# Altium schematic sheet MOTOR CONTROL.SchDoc
size A4
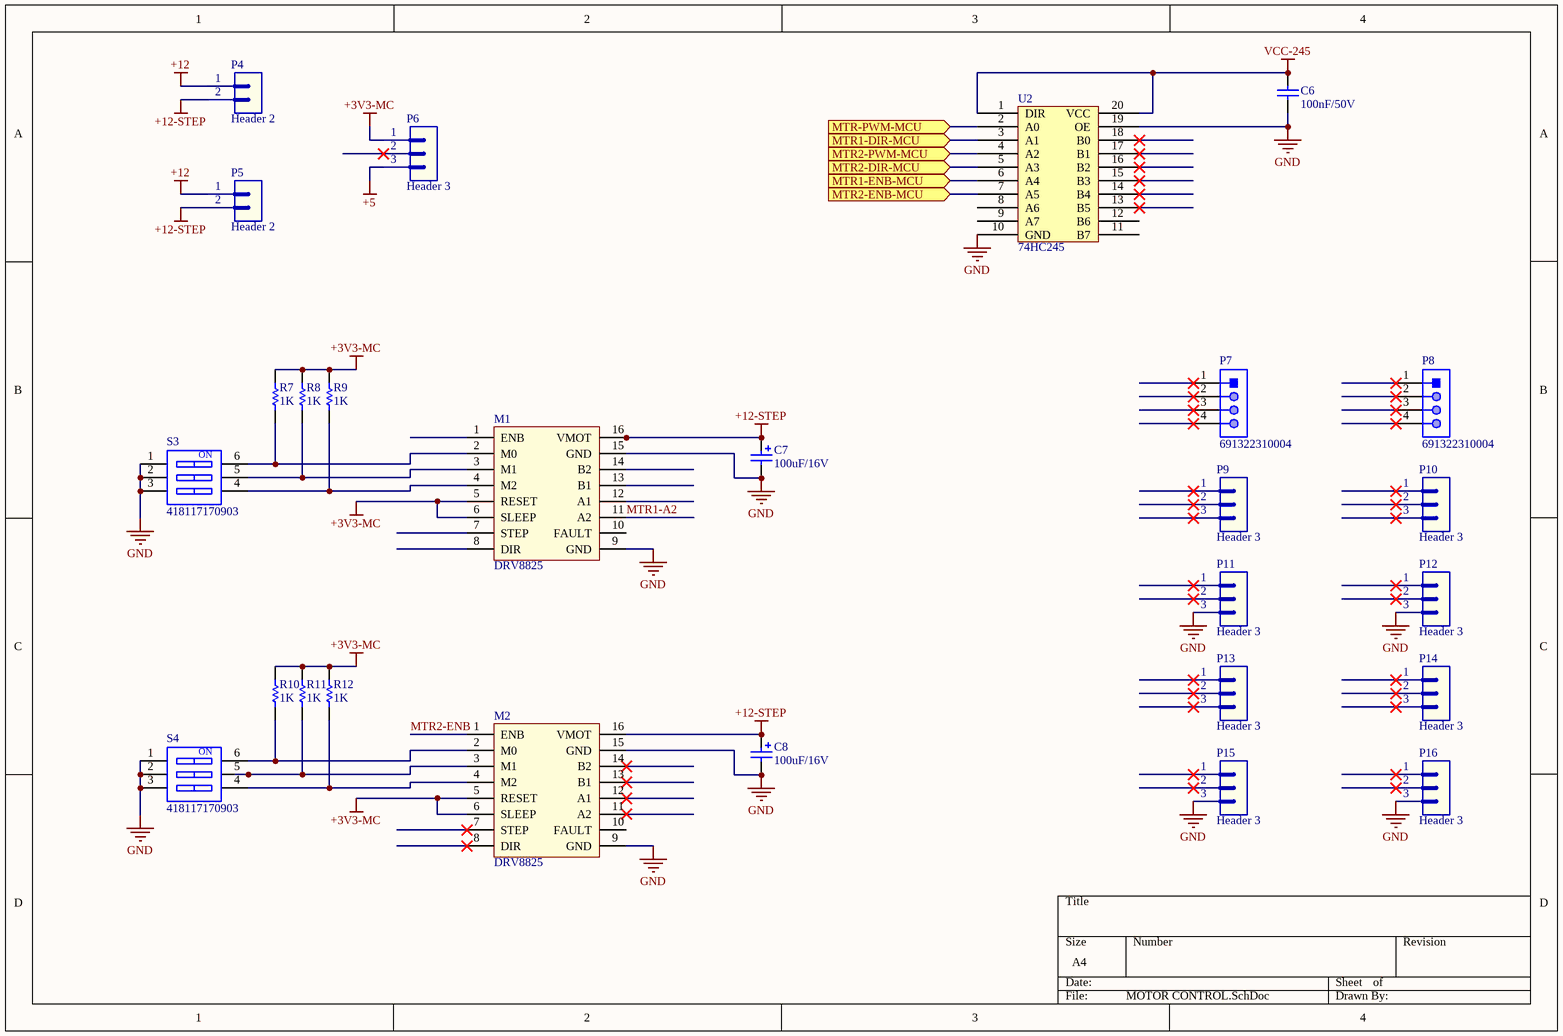
[diagram p0: MOTOR CONTROL.SchDoc]

## Parts
C6  value 100nF/50V  [CAP-SM-0805]  (hidden comment: Cap-100nF-50V-0805)
C7  value 100uF/16V  [CAP-SM-AL-SIZE-D-D6L6]  (hidden comment: Cap-Al-100uF-16V-D6L5)
C8  value 100uF/16V  [CAP-SM-AL-SIZE-D-D6L6]  (hidden comment: Cap-Al-100uF-16V-D6L5)
M1  DRV8825
M2  DRV8825
P4  Header 2  [JP2]
P5  Header 2  [JP2]
P6  Header 3  [JP3]
P7  691322310004  [691322310004]
P8  691322310004  [691322310004]
P9  Header 3  [JP3]
P10  Header 3  [JP3]
P11  Header 3  [JP3]
P12  Header 3  [JP3]
P13  Header 3  [JP3]
P14  Header 3  [JP3]
P15  Header 3  [JP3]
P16  Header 3  [JP3]
R7  value 1K  [RES-SM-0805]  (hidden comment: Res-1K-0805)
R8  value 1K  [RES-SM-0805]  (hidden comment: Res-1K-0805)
R9  value 1K  [RES-SM-0805]  (hidden comment: Res-1K-0805)
R10  value 1K  [RES-SM-0805]  (hidden comment: Res-1K-0805)
R11  value 1K  [RES-SM-0805]  (hidden comment: Res-1K-0805)
R12  value 1K  [RES-SM-0805]  (hidden comment: Res-1K-0805)
S3  418117170903  [418117170903]
S4  418117170903  [418117170903]
U2  74HC245  [DIP20/W0.3]

## Ports
MTR1-DIR-MCU (in), MTR1-ENB-MCU (in), MTR2-DIR-MCU (in), MTR2-ENB-MCU (in), MTR2-PWM-MCU (in), MTR-PWM-MCU (in)

## Nets
+3V3-MC: M1.5(RESET) M1.6(SLEEP) M2.5(RESET) M2.6(SLEEP) P6.1 R7.2 R8.2 R9.2 R10.2 R11.2 R12.2
+5: P6.3
+12: P4.1 P5.1
+12-STEP: C7.1 C8.1 M1.16(VMOT) M2.16(VMOT) P4.2 P5.2
GND: C6.1 C7.2 C8.2 M1.9(GND) M1.15(GND) M2.9(GND) M2.15(GND) P11.3 P12.3 P15.3 P16.3 S3.1 S3.2 S3.3 S4.1 S4.2 S4.3 U2.10(GND) U2.19(OE)
VCC-245: C6.2 U2.1(DIR) U2.20(VCC)
MTR1-A2: M1.11(A2)
MTR1-DIR-MCU: U2.3(A1) ; port MTR1-DIR-MCU
MTR1-ENB-MCU: U2.6(A4) ; port MTR1-ENB-MCU
MTR2-DIR-MCU: U2.5(A3) ; port MTR2-DIR-MCU
MTR2-ENB: M2.1(ENB)
MTR2-ENB-MCU: U2.7(A5) ; port MTR2-ENB-MCU
MTR2-PWM-MCU: U2.4(A2) ; port MTR2-PWM-MCU
MTR-PWM-MCU: U2.2(A0) ; port MTR-PWM-MCU
NetM1_2: M1.2(M0) R7.1 S3.6
NetM1_3: M1.3(M1) R8.1 S3.5
NetM1_4: M1.4(M2) R9.1 S3.4
NetM2_2: M2.2(M0) R10.1 S4.6
NetM2_3: M2.3(M1) R11.1 S4.5
NetM2_4: M2.4(M2) R12.1 S4.4

Not connected (* = marked no-connect by the designer): M1 1(ENB) 7(STEP) 8(DIR) 10(FAULT) 12(A1) 13(B1) 14(B2); M2 7(STEP)* 8(DIR)* 10(FAULT) 11(A2)* 12(A1)* 13(B1)* 14(B2)*; P6 2*; P7 1* 2* 3* 4*; P8 1* 2* 3* 4*; P9 1* 2* 3*; P10 1* 2* 3*; P11 1* 2*; P12 1* 2*; P13 1* 2* 3*; P14 1* 2* 3*; P15 1* 2*; P16 1* 2*; U2 8(A6) 9(A7) 11(B7) 12(B6) 13(B5)* 14(B4)* 15(B3)* 16(B2)* 17(B1)* 18(B0)*

## Notes on the sheet
- (in symbol 418117170903) ON

## Library data of the parts
C6 = Cap-100nF-50V-0805: CAP CER 0.1UF 50V Y5V 0805; Manufacturer: Samsung Electro-Mechanics; Manufacturer Part Number: CL21F104ZBCNNNC; Local Supplier: thegioiic; Local Supplier Link: https://thegioiic.com/products/tu-100nf-0-1uf-50v-0805; Supplier 1: Digikey; Supplier 1 Part Number: 1276-1007-1-ND; Supplier 1 Link: https://www.digikey.com/product-detail/en/samsung-electro-mechanics/CL21F104ZBCNNNC/1276-1007-1-ND/3889093
C7 C8 = Cap-Al-100uF-16V-D6L5: CAP ALUM 100UF 20% 16V SMD; Manufacturer: Nichicon; Manufacturer Part Number: UWX1C101MCL1GB; Local Supplier: thegioiic; Local Supplier Link: https://thegioiic.com/products/tu-nhom-smd-100uf-16v-d6-3l5-4; Supplier 1: Digikey; Supplier 1 Part Number: 493-2105-1-ND; Supplier 1 Link: https://www.digikey.com/product-detail/en/nichicon/UWX1C101MCL1GB/493-2105-1-ND/590080
P4 P5 = Header 2: Header, 2-Pin; LatestRevisionDate: 17-Jul-2002; LatestRevisionNote: Re-released for DXP Platform.; Publisher: Altium Limited
P6 P9-P16 = Header 3: Header, 3-Pin; LatestRevisionDate: 17-Jul-2002; LatestRevisionNote: Re-released for DXP Platform.; Publisher: Altium Limited
P7 P8 = 691322310004: WR-TBL Serie 322 Horizontal PCB Header, Pluggable, pitch 3.81mm, 4p; Compliance: RoHS; Modularity: No; Pin Number: 4; Rated Current [UL]: 10A; Working Voltage [UL]: 300VAC; ComponentLink1Description: Manufacturer; ComponentLink1URL: http://www.we-online.de; ComponentLink2URL: https://katalog.we-online.de/em/datasheet/691322310004.pdf; ComponentLink2Description: Datasheet; Mounting Technology: THT; Part Number: 691322310004; Packaging: Box; Operating Temperature: -40 to +105degC; PCB/Cable/Panel: PCB; Pitch: 3.81mm; Published Date: October 2019; Type: Horizontal; Publisher: Wurth Elektronik; Application: Pluggable
R7-R12 = Res-1K-0805: RES 1K OHM 1% 1/4W 0805; Manufacturer: Stackpole Electronics Inc; Manufacturer Part Number: RNCP0805FTD1K00; Local Supplier: thegioiic; Local Supplier Link: https://thegioiic.com/products/dien-tro-1k-ohm-0805-5; Supplier 1: Digikey; Supplier 1 Link: https://www.digikey.com/product-detail/en/stackpole-electronics-inc/RNCP0805FTD1K00/RNCP0805FTD1K00CT-ND/2240568; Supplier 1 Part Number: RNCP0805FTD1K00CT-ND
S3 S4 = 418117170903: WS-DITV Compact THT Dip Switch, Flat Actuator, pitch 2.54mm, 3p; Operation Force: 800g; Pole Number: 3; Actuator Type: Flat Type; Circuit: SPST-NO; Rated Current Switching: 25mA; Rated Current Non-Switching: 100mA; Rated Voltage Non-Switching: 50VDC; Rated Voltage Switching: 24VDC; ComponentLink1Description: Manufacturer; ComponentLink1URL: http://www.we-online.de; ComponentLink2Description: Datasheet; ComponentLink2URL: https://katalog.we-online.com/em/datasheet/418117170903.pdf; Pitch: 2.54mm; Contact Material: Copper Alloy; Mounting Technology: THT; Operating Temperature: -40 to +85degC; Contact Plating: Gold; Packaging: Tube; Part Number: 418117170903; Publisher: Wurth Elektronik; Published Date: September 2019
U2 = 74HC245: Octal bus tranceiver